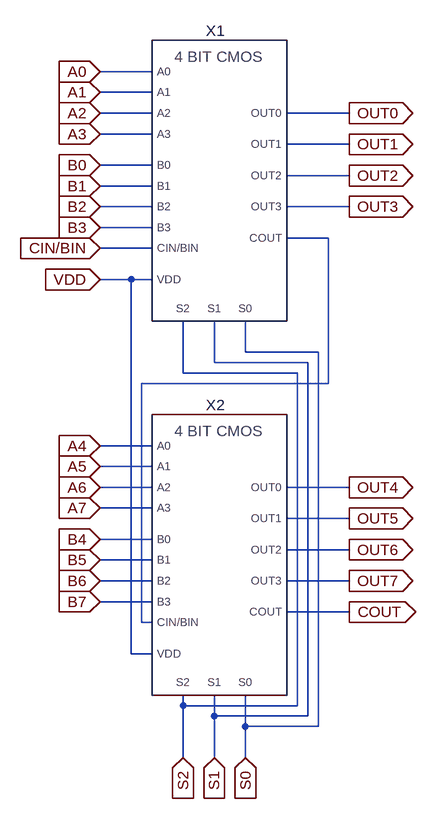
[diagram p0: schematic Draft7.asc]
Draft7.asc, the LTspice schematic file:
Version 4
SHEET 1 1172 872
WIRE 192 -272 112 -272
WIRE 192 -240 112 -240
WIRE 192 -208 112 -208
WIRE 496 -208 400 -208
WIRE 192 -176 112 -176
WIRE 496 -160 400 -160
WIRE 192 -128 112 -128
WIRE 496 -112 400 -112
WIRE 192 -96 112 -96
WIRE 192 -64 112 -64
WIRE 496 -64 400 -64
WIRE 192 -32 112 -32
WIRE 464 -16 400 -16
WIRE 192 0 112 0
WIRE 160 48 112 48
WIRE 192 48 160 48
WIRE 336 160 336 112
WIRE 448 160 336 160
WIRE 288 176 288 112
WIRE 432 176 288 176
WIRE 240 192 240 112
WIRE 416 192 240 192
WIRE 464 208 464 -16
WIRE 464 208 176 208
WIRE 192 304 112 304
WIRE 192 336 112 336
WIRE 192 368 112 368
WIRE 496 368 400 368
WIRE 192 400 112 400
WIRE 496 416 400 416
WIRE 192 448 112 448
WIRE 496 464 400 464
WIRE 192 480 112 480
WIRE 192 512 112 512
WIRE 496 512 400 512
WIRE 192 544 112 544
WIRE 496 560 400 560
WIRE 176 576 176 208
WIRE 192 576 176 576
WIRE 160 624 160 48
WIRE 192 624 160 624
WIRE 240 704 240 688
WIRE 416 704 416 192
WIRE 416 704 240 704
WIRE 288 720 288 688
WIRE 432 720 432 176
WIRE 432 720 288 720
WIRE 336 736 336 688
WIRE 448 736 448 160
WIRE 448 736 336 736
WIRE 240 784 240 704
WIRE 288 784 288 720
WIRE 336 784 336 736
FLAG 112 -272 A0
IOPIN 112 -272 In
FLAG 112 -240 A1
IOPIN 112 -240 In
FLAG 112 -208 A2
IOPIN 112 -208 In
FLAG 112 -176 A3
IOPIN 112 -176 In
FLAG 112 -128 B0
IOPIN 112 -128 In
FLAG 112 -96 B1
IOPIN 112 -96 In
FLAG 112 -64 B2
IOPIN 112 -64 In
FLAG 112 -32 B3
IOPIN 112 -32 In
FLAG 112 0 CIN/BIN
IOPIN 112 0 In
FLAG 112 48 VDD
IOPIN 112 48 In
FLAG 112 304 A4
IOPIN 112 304 In
FLAG 112 336 A5
IOPIN 112 336 In
FLAG 112 368 A6
IOPIN 112 368 In
FLAG 112 400 A7
IOPIN 112 400 In
FLAG 112 448 B4
IOPIN 112 448 In
FLAG 112 480 B5
IOPIN 112 480 In
FLAG 112 512 B6
IOPIN 112 512 In
FLAG 112 544 B7
IOPIN 112 544 In
FLAG 496 -208 OUT0
IOPIN 496 -208 Out
FLAG 496 -160 OUT1
IOPIN 496 -160 Out
FLAG 496 -112 OUT2
IOPIN 496 -112 Out
FLAG 496 -64 OUT3
IOPIN 496 -64 Out
FLAG 496 368 OUT4
IOPIN 496 368 Out
FLAG 496 416 OUT5
IOPIN 496 416 Out
FLAG 496 464 OUT6
IOPIN 496 464 Out
FLAG 496 512 OUT7
IOPIN 496 512 Out
FLAG 240 784 S2
IOPIN 240 784 In
FLAG 288 784 S1
IOPIN 288 784 In
FLAG 336 784 S0
IOPIN 336 784 In
FLAG 496 560 COUT
IOPIN 496 560 Out
SYMBOL FourBitCMOS 288 -96 R0
SYMATTR InstName X1
SYMBOL FourBitCMOS 288 480 R0
SYMATTR InstName X2

The netlist it stands for:
* Draft7.asc
XX1 A0 A1 A2 A3 B0 B1 B2 B3 CIN/BIN S0 S1 S2 VDD N001 OUT0 OUT1 OUT2 OUT3 FourBitCMOS  ; pins A0 A1 A2 A3 B0 B1 B2 B3 CIN/BIN S0 S1 S2 VDD COUT OUT0 OUT1 OUT2 OUT3
XX2 A4 A5 A6 A7 B4 B5 B6 B7 N001 S0 S1 S2 VDD COUT OUT4 OUT5 OUT6 OUT7 FourBitCMOS  ; pins A0 A1 A2 A3 B0 B1 B2 B3 CIN/BIN S0 S1 S2 VDD COUT OUT0 OUT1 OUT2 OUT3
.backanno
.end